# EAGLE design 4x4 (EAGLE 9.6.1)
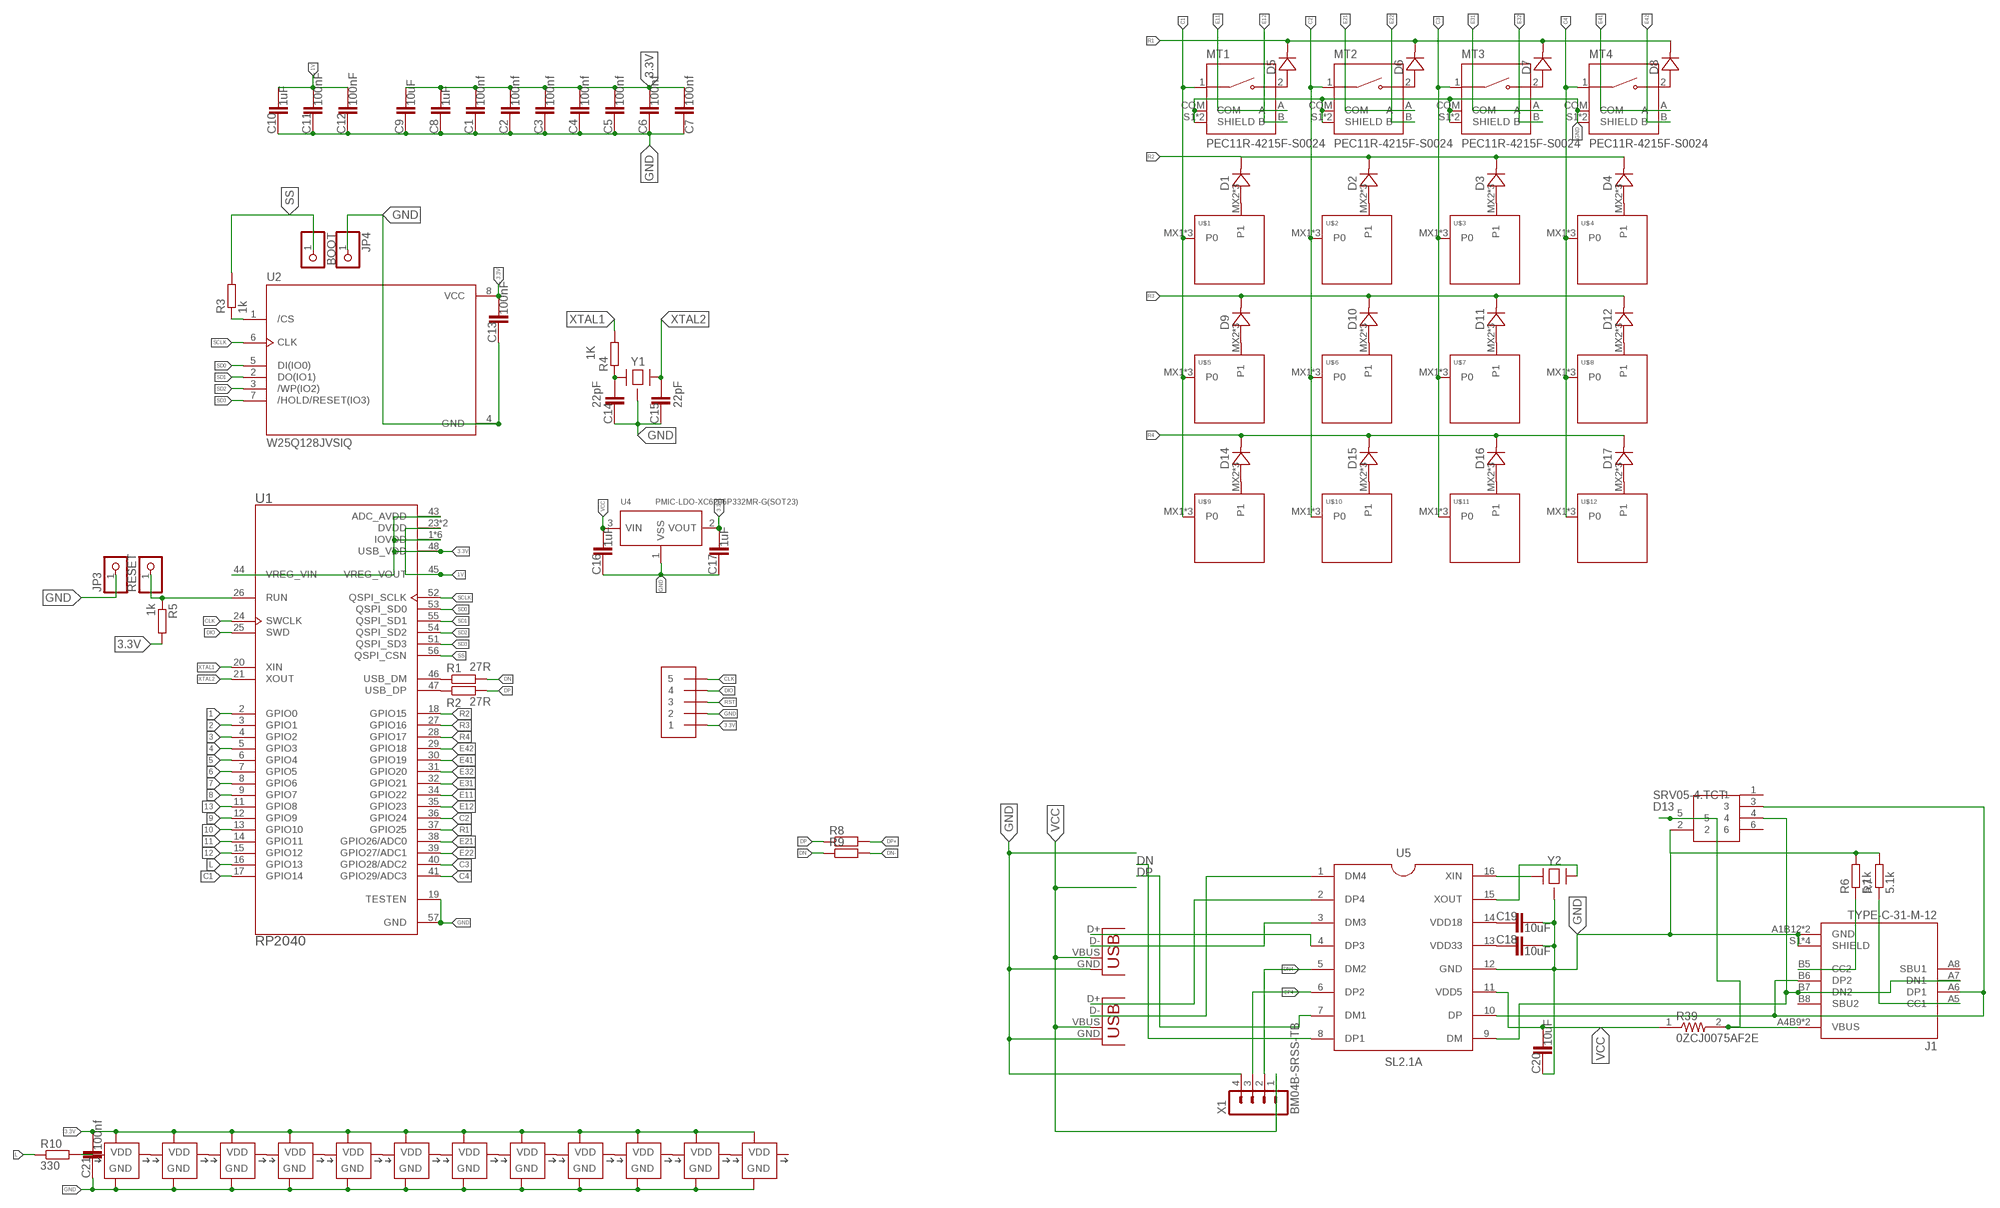
[diagram p0: schematic, sheet 1]

## Parts
BOOT  PINHD-1X1  [1X01]
C1  100nf  CAPACITOR-0603  [C0603]
C2  100nf  CAPACITOR-0603  [C0603]
C3  100nf  CAPACITOR-0603  [C0603]
C4  100nf  CAPACITOR-0603  [C0603]
C5  100nf  CAPACITOR-0603  [C0603]
C6  100nf  CAPACITOR-0603  [C0603]
C7  100nf  CAPACITOR-0603  [C0603]
C8  1uF  CAPACITOR-0603  [C0603]
C9  10uF  CAPACITOR-0603  [C0603]
C10  1uF  CAPACITOR-0603  [C0603]
C11  100nF  CAPACITOR-0603  [C0603]
C12  100nF  CAPACITOR-0603  [C0603]
C13  100nF  CAPACITOR-0603  [C0603]
C14  22pF  CAPACITOR-0603  [C0603]
C15  22pF  CAPACITOR-0603  [C0603]
C16  1uF  CAPACITOR-0603  [C0603]
C17  1uF  CAPACITOR-0603  [C0603]
C18  10uF  CAPACITOR-0603  [C0603]
C19  10uF  CAPACITOR-0603  [C0603]
C20  10uF  CAPACITOR-0603  [C0603]
C21  100nf  CAPACITOR-0603  [C0603]
D1  DIODE-SOD-123  [SOD-123]
D2  DIODE-SOD-123  [SOD-123]
D3  DIODE-SOD-123  [SOD-123]
D4  DIODE-SOD-123  [SOD-123]
D5  DIODE-SOD-123  [SOD-123]
D6  DIODE-SOD-123  [SOD-123]
D7  DIODE-SOD-123  [SOD-123]
D8  DIODE-SOD-123  [SOD-123]
D9  DIODE-SOD-123  [SOD-123]
D10  DIODE-SOD-123  [SOD-123]
D11  DIODE-SOD-123  [SOD-123]
D12  DIODE-SOD-123  [SOD-123]
D13  SRV05-4.TCT  [SOT95P280X145-6N]
D14  DIODE-SOD-123  [SOD-123]
D15  DIODE-SOD-123  [SOD-123]
D16  DIODE-SOD-123  [SOD-123]
D17  DIODE-SOD-123  [SOD-123]
J1  TYPE-C-31-M-12  [HRO_TYPE-C-31-M-12]
J2  1X5  [1X05-3.5MM]
JP3  PINHD-1X1CB  [1X01-CLEANBIG]
JP4  PINHD-1X1CB  [1X01-CLEANBIG]
MT1  PEC11R-4215F-S0024  [XDCR_PEC11R-4215F-S0024]
MT2  PEC11R-4215F-S0024  [XDCR_PEC11R-4215F-S0024]
MT3  PEC11R-4215F-S0024  [XDCR_PEC11R-4215F-S0024]
MT4  PEC11R-4215F-S0024  [XDCR_PEC11R-4215F-S0024]
R1  27R  RESISTOR-0603  [R0603]
R2  27R  RESISTOR-0603  [R0603]
R3  1k  RESISTOR-0603  [R0603]
R4  1K  RESISTOR-0603  [R0603]
R5  1k  RESISTOR-0603  [R0603]
R6  5.1k  RESISTOR-0603  [R0603]
R7  5.1k  RESISTOR-0603  [R0603]
R8  RESISTOR-0405  [R0402]
R9  RESISTOR-0405  [R0402]
R10  330  RESISTOR-0603  [R0603]
R39  0ZCJ0075AF2E  [RESC3216X125N]
RESET  PINHD-1X1  [1X01]
U1  RP2040  [QFN40P700X700X90-57N]
U2  W25Q128JVSIQ  [SOIC127P790X216-8N]
U4  PMIC-LDO-XC6206P332MR-G(SOT23)  [SOT-23]
U5  SL2.1A  [SO16]
U$1  KEYSWITCH-PLAIN-MXHSPCB-1U  [MXHSPCB-1U]
U$2  KEYSWITCH-PLAIN-MXHSPCB-1U  [MXHSPCB-1U]
U$3  KEYSWITCH-PLAIN-MXHSPCB-1U  [MXHSPCB-1U]
U$4  KEYSWITCH-PLAIN-MXHSPCB-1U  [MXHSPCB-1U]
U$5  KEYSWITCH-PLAIN-MXHSPCB-1U  [MXHSPCB-1U]
U$6  KEYSWITCH-PLAIN-MXHSPCB-1U  [MXHSPCB-1U]
U$7  KEYSWITCH-PLAIN-MXHSPCB-1U  [MXHSPCB-1U]
U$8  KEYSWITCH-PLAIN-MXHSPCB-1U  [MXHSPCB-1U]
U$9  KEYSWITCH-PLAIN-MXHSPCB-1U  [MXHSPCB-1U]
U$10  KEYSWITCH-PLAIN-MXHSPCB-1U  [MXHSPCB-1U]
U$11  KEYSWITCH-PLAIN-MXHSPCB-1U  [MXHSPCB-1U]
U$12  KEYSWITCH-PLAIN-MXHSPCB-1U  [MXHSPCB-1U]
U$13  SK6812MINI  [LED-3535]
U$14  SK6812MINI  [LED-3535]
U$15  SK6812MINI  [LED-3535]
U$16  SK6812MINI  [LED-3535]
U$17  SK6812MINI  [LED-3535]
U$18  SK6812MINI  [LED-3535]
U$19  SK6812MINI  [LED-3535]
U$20  SK6812MINI  [LED-3535]
U$21  SK6812MINI  [LED-3535]
U$22  SK6812MINI  [LED-3535]
U$23  SK6812MINI  [LED-3535]
U$24  SK6812MINI  [LED-3535]
X1  BM04B-SRSS-TB  [BM04B-SRSS-TB]
X4  USB-A-H  [USB-A-H]
X5  USB-A-H  [USB-A-H]
Y1  CRYSTAL-4PIN-3.2X2.5  [CRYSTAL-3.2X2.5]
Y2  CRYSTAL-4PIN-3.2X2.5  [CRYSTAL-3.2X2.5]

## Nets
1: U1.2(GPIO0)
1V: C10.2 C11.2 C12.2 U1.23(DVDD) U1.45(VREG_VOUT) U1.50(DVDD)
2: U1.3(GPIO1)
3: U1.4(GPIO2)
3.3V: C1.2 C2.2 C3.2 C4.2 C5.2 C6.2 C7.2 C8.2 C9.2 C13.2 C17.2 C21.2 J2.1 R5.2 U1.1(IOVDD) U1.10(IOVDD) U1.22(IOVDD) U1.33(IOVDD) U1.42(IOVDD) U1.43(ADC_AVDD) U1.44(VREG_VIN) U1.48(USB_VDD) U1.49(IOVDD) U2.8(VCC) U4.2(VOUT) U$13.4(VDD) U$14.4(VDD) U$15.4(VDD) U$16.4(VDD) U$17.4(VDD) U$18.4(VDD) U$19.4(VDD) U$20.4(VDD) U$21.4(VDD) U$22.4(VDD) U$23.4(VDD) U$24.4(VDD)
4: U1.5(GPIO3)
5: U1.6(GPIO4)
6: U1.7(GPIO5)
7: U1.8(GPIO6)
8: U1.9(GPIO7)
9: U1.12(GPIO9)
10: U1.13(GPIO10)
11: U1.14(GPIO11)
12: U1.15(GPIO12)
13: U1.11(GPIO8)
C1: MT1.1 U1.17(GPIO14) U$1.MX1(P0) U$1.P$1(P0) U$1.P$2(P0) U$5.MX1(P0) U$5.P$1(P0) U$5.P$2(P0) U$9.MX1(P0) U$9.P$1(P0) U$9.P$2(P0)
C2: MT2.1 U1.36(GPIO24) U$2.MX1(P0) U$2.P$1(P0) U$2.P$2(P0) U$6.MX1(P0) U$6.P$1(P0) U$6.P$2(P0) U$10.MX1(P0) U$10.P$1(P0) U$10.P$2(P0)
C3: MT3.1 U1.40(GPIO28/ADC2) U$3.MX1(P0) U$3.P$1(P0) U$3.P$2(P0) U$7.MX1(P0) U$7.P$1(P0) U$7.P$2(P0) U$11.MX1(P0) U$11.P$1(P0) U$11.P$2(P0)
C4: MT4.1 U1.41(GPIO29/ADC3) U$4.MX1(P0) U$4.P$1(P0) U$4.P$2(P0) U$8.MX1(P0) U$8.P$1(P0) U$8.P$2(P0) U$12.MX1(P0) U$12.P$1(P0) U$12.P$2(P0)
CLK: J2.5 U1.24(SWCLK)
DIO: J2.4 U1.25(SWD)
DN: R1.2 R9.1 U5.8(DP1)
DN4: U5.5(DM2) X1.2
DN-: D13.4 J1.A7(DN1) J1.B7(DN2) R9.2 U5.9(DM)
DP: R2.2 R8.1 U5.7(DM1)
DP4: U5.6(DP2) X1.3
DP+: D13.3 J1.A6(DP1) J1.B6(DP2) R8.2 U5.10(DP)
E11: MT1.A U1.34(GPIO22)
E12: MT1.B U1.35(GPIO23)
E21: MT2.A U1.38(GPIO26/ADC0)
E22: MT2.B U1.39(GPIO27/ADC1)
E31: MT3.A U1.32(GPIO21)
E32: MT3.B U1.31(GPIO20)
E41: MT4.A U1.30(GPIO19)
E42: MT4.B U1.29(GPIO18)
GND: C1.1 C2.1 C3.1 C4.1 C5.1 C6.1 C7.1 C8.1 C9.1 C10.1 C11.1 C12.1 C13.1 C14.1 C15.1 C16.1 C17.1 C18.2 C19.2 C20.1 C21.1 D13.2 J1.A1B12(GND) J1.B1A12(GND) J1.S1(SHIELD) J1.S2(SHIELD) J1.S3(SHIELD) J1.S4(SHIELD) J2.2 JP3.1 JP4.1 MT1.COM MT1.S1(SHIELD) MT1.S2(SHIELD) MT2.COM MT2.S1(SHIELD) MT2.S2(SHIELD) MT3.COM MT3.S1(SHIELD) MT3.S2(SHIELD) MT4.COM MT4.S1(SHIELD) MT4.S2(SHIELD) R6.2 R7.2 U1.19(TESTEN) U1.57(GND) U2.4(GND) U4.1(VSS) U5.12(GND) U$13.2(GND) U$14.2(GND) U$15.2(GND) U$16.2(GND) U$17.2(GND) U$18.2(GND) U$19.2(GND) U$20.2(GND) U$21.2(GND) U$22.2(GND) U$23.2(GND) U$24.2(GND) X1.4 X4.GND X5.GND Y1.2(GND) Y1.4(GND) Y2.2(GND) Y2.4(GND)
L: R10.1 U1.16(GPIO13)
N$7: D13.5 J1.A4B9(VBUS) J1.B4A9(VBUS) R39.2
N$8: U$13.1(DI) U$19.3(DO)
N$9: U$13.3(DO) U$14.1(DI)
N$10: U$14.3(DO) U$15.1(DI)
N$11: U$15.3(DO) U$16.1(DI)
N$12: U$16.3(DO) U$20.1(DI)
N$13: R1.1 U1.46(USB_DM)
N$14: R2.1 U1.47(USB_DP)
N$15: C14.2 R4.1 Y1.1
N$16: R3.1 U2.1(/CS)
N$17: D1.A U$1.MX2(P1) U$1.P$3(P1) U$1.P$4(P1)
N$18: D2.A U$2.MX2(P1) U$2.P$3(P1) U$2.P$4(P1)
N$19: C18.1 U5.13(VDD33)
N$20: C19.1 U5.14(VDD18)
N$21: U5.16(XIN) Y2.1
N$22: U5.15(XOUT) Y2.3
N$23: U5.2(DP4) X5.D+
N$24: U5.1(DM4) X5.D-
N$25: U$20.3(DO) U$21.1(DI)
N$26: U$21.3(DO) U$22.1(DI)
N$27: U5.3(DM3) X4.D-
N$28: U5.4(DP3) X4.D+
N$29: U$22.3(DO) U$23.1(DI)
N$30: U$23.3(DO) U$24.1(DI)
N$31: D3.A U$3.MX2(P1) U$3.P$3(P1) U$3.P$4(P1)
N$32: D4.A U$4.MX2(P1) U$4.P$3(P1) U$4.P$4(P1)
N$33: D5.A MT1.2
N$34: D6.A MT2.2
N$35: D7.A MT3.2
N$36: D8.A MT4.2
N$37: D9.A U$5.MX2(P1) U$5.P$3(P1) U$5.P$4(P1)
N$38: D10.A U$6.MX2(P1) U$6.P$3(P1) U$6.P$4(P1)
N$39: D11.A U$7.MX2(P1) U$7.P$3(P1) U$7.P$4(P1)
N$40: D12.A U$8.MX2(P1) U$8.P$3(P1) U$8.P$4(P1)
N$41: D14.A U$9.MX2(P1) U$9.P$3(P1) U$9.P$4(P1)
N$42: D15.A U$10.MX2(P1) U$10.P$3(P1) U$10.P$4(P1)
N$43: D16.A U$11.MX2(P1) U$11.P$3(P1) U$11.P$4(P1)
N$44: D17.A U$12.MX2(P1) U$12.P$3(P1) U$12.P$4(P1)
N$107: U$17.3(DO) U$18.1(DI)
N$108: U$18.3(DO) U$19.1(DI)
N$153: J1.B5(CC2) R6.1
N$154: J1.A5(CC1) R7.1
R1: D5.C D6.C D7.C D8.C U1.37(GPIO25)
R2: D1.C D2.C D3.C D4.C U1.18(GPIO15)
R3: D9.C D10.C D11.C D12.C U1.27(GPIO16)
R4: D14.C D15.C D16.C D17.C U1.28(GPIO17)
RGB: R10.2 U$17.1(DI)
RST: J2.3 R5.1 RESET.1 U1.26(RUN)
SCLK: U1.52(QSPI_SCLK) U2.6(CLK)
SD0: U1.53(QSPI_SD0) U2.5(DI(IO0))
SD1: U1.55(QSPI_SD1) U2.2(DO(IO1))
SD2: U1.54(QSPI_SD2) U2.3(/WP(IO2))
SD3: U1.51(QSPI_SD3) U2.7(/HOLD/RESET(IO3))
SS: BOOT.1 R3.2 U1.56(QSPI_CSN)
VCC: C16.2 C20.2 R39.1 U4.3(VIN) U5.11(VDD5) X1.1 X4.VBUS X5.VBUS
XTAL1: R4.2 U1.20(XIN)
XTAL2: C15.2 U1.21(XOUT) Y1.3
Unconnected: D13.1 D13.6 J1.A8(SBU1) J1.B8(SBU2) U$24.3(DO)

## Library data of the parts
BOOT JP3 JP4 RESET = adafruit:PINHD-1X1: Pin header 1x1 for 0.1" spacing With round pins
C1-C21 = Components:CAPACITOR
D1-D12 D14-D17 = Components:DIODE: Standard 1N4148 diode
D13 = SRV05-4.TCT:SRV05-4.TCT: Semtech SRV05-4.TCT, Uni-Directional TVS Diode Array, 300W, 6-Pin SOT-23 Source: Datasheet Check prices; AVAILABILITY: In Stock; DESCRIPTION: 17.5V Clamp 12A (8/20µs) Ipp Tvs Diode Surface Mount SOT-23-6; MF: Semtech; MP: SRV05-4.TC; PACKAGE: SOT-23-6 Semtech; PRICE: None; PURCHASE-URL: https://pricing.snapeda.com/search/part/SRV05-4.TC/?ref=eda
J1 = TYPE-C-31-M-12:TYPE-C-31-M-12: USB Connectors 24 Receptacle 1 8.94*7.3mm RoHS; AVAILABILITY: Unavailable; DESCRIPTION: USB Connectors 24 Receptacle 1 8.94*7.3mm RoHS; MF: HRO Electronics Co., Ltd.; MP: TYPE-C-31-M-12; PACKAGE: Package; PRICE: None
J2 = adafruit:1X5
MT1-MT4 = PEC11R-4215F-S0024:PEC11R-4215F-S0024: Incremental Encoder, 12 Mm, Contact Rating 10 Ma - 5 Vdc Check prices; AVAILABILITY: In Stock; DESCRIPTION: Rotary Encoder Mechanical 24 Quadrature (Incremental) Vertical; MF: Bourns; MP: PEC11R-4215F-S0024; PACKAGE: None; PRICE: None
R1-R10 = Components:RESISTOR
R39 = fuse:0ZCJ0075AF2E: PTC RESTTBLE 0.75A 16V CHIP 1206 Check prices; AVAILABILITY: In Stock; DESCRIPTION: 1206 SMT PPTC | 0.75 Ih | 16V; MF: Bel Fuse; MP: 0ZCJ0075AF2E; PACKAGE: 1206 Bel Fuse; PRICE: None; PURCHASE-URL: https://pricing.snapeda.com/search/part/0ZCJ0075AF2E/?ref=eda
U1 = RP2040:RP2040: Check availability; AVAILABILITY: In Stock; DESCRIPTION: RP2040 chip for Raspberry Pi Pico - ARM® Cortex®-M0+ MCU 32-Bit; MF: Raspberry Pi; MP: RP2040; PACKAGE: None; PRICE: None; PURCHASE-URL: https://pricing.snapeda.com/search/part/RP2040/?ref=eda
U2 = W25Q128JVSIQ:W25Q128JVSIQ: Check availability; AVAILABILITY: In Stock; DESCRIPTION: FLASH - NOR Memory IC 128Mb (16M x 8) SPI - Quad I/O, QPI, DTR 133 MHz 8-SOIC; MF: Winbond Electronics; MP: W25Q128JVSIQ; PACKAGE: SOIC-8 Winbond; PRICE: None; PURCHASE-URL: https://pricing.snapeda.com/search/part/W25Q128JVSIQ/?ref=eda
U4 = C5446-XC6206P332MR-G_SOT23_:PMIC-LDO-XC6206P332MR-G(SOT23): 310030099 Check availability; AVAILABILITY: In Stock; DESCRIPTION: Linear Voltage Regulator IC Positive Fixed 1 Output 200mA SOT-23; MF: Torex; MP: XC6206P332MR-G; PACKAGE: SOT-23-3 Torex; PRICE: None; PURCHASE-URL: https://pricing.snapeda.com/search/part/XC6206P332MR-G/?ref=eda
U5 = SL2.1A:SL2.1A: Check prices; AVAILABILITY: Not in stock; DESCRIPTION: USB 2.0 HIGH SPEED 4-PORT HUB CONTROLLER; MF: CoreChips ShenZhen CO.,Ltd; MP: SL2.1A; PACKAGE: Package; PRICE: None
U$1-U$12 = Keyboard:KEYSWITCH-PLAIN
U$13-U$24 = SK6812MINI:SK6812MINI: Check availability; AVAILABILITY: Not in stock; DESCRIPTION: INTEGRATED LIGHT SOURCE INTELLIGENT CONTROL OF CHIP-ON-TOP SMD TYPE LED; MF: DONGGUANG OPSCO OPTOELECTRONICS CO., LTD; MP: SK6812MINI; PACKAGE: Package; PRICE: None
X1 = con-JST SH:BM04B-SRSS: JST SH series header 1.00mm pitch disconnectable crimp style connectors, vertical (side entry type), 4 pins
X4 X5 = con-usb:USB: USB Connectors
Y1 Y2 = Components:CRYSTAL-4PIN

## Board
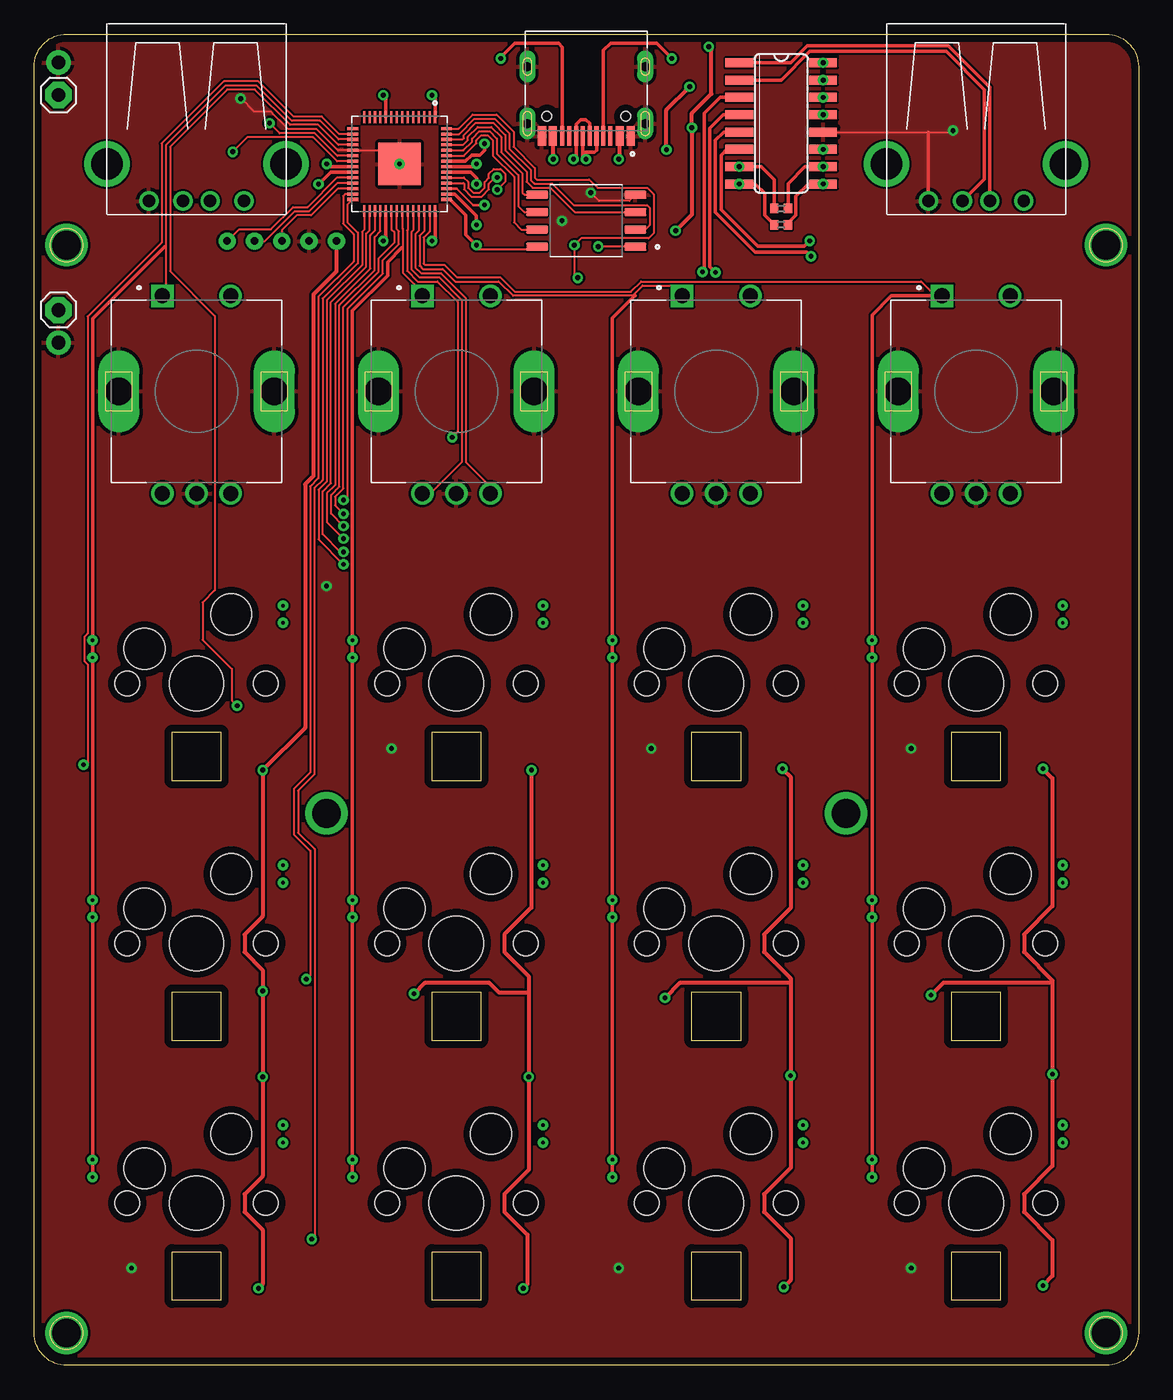
[diagram p1: board, top side]
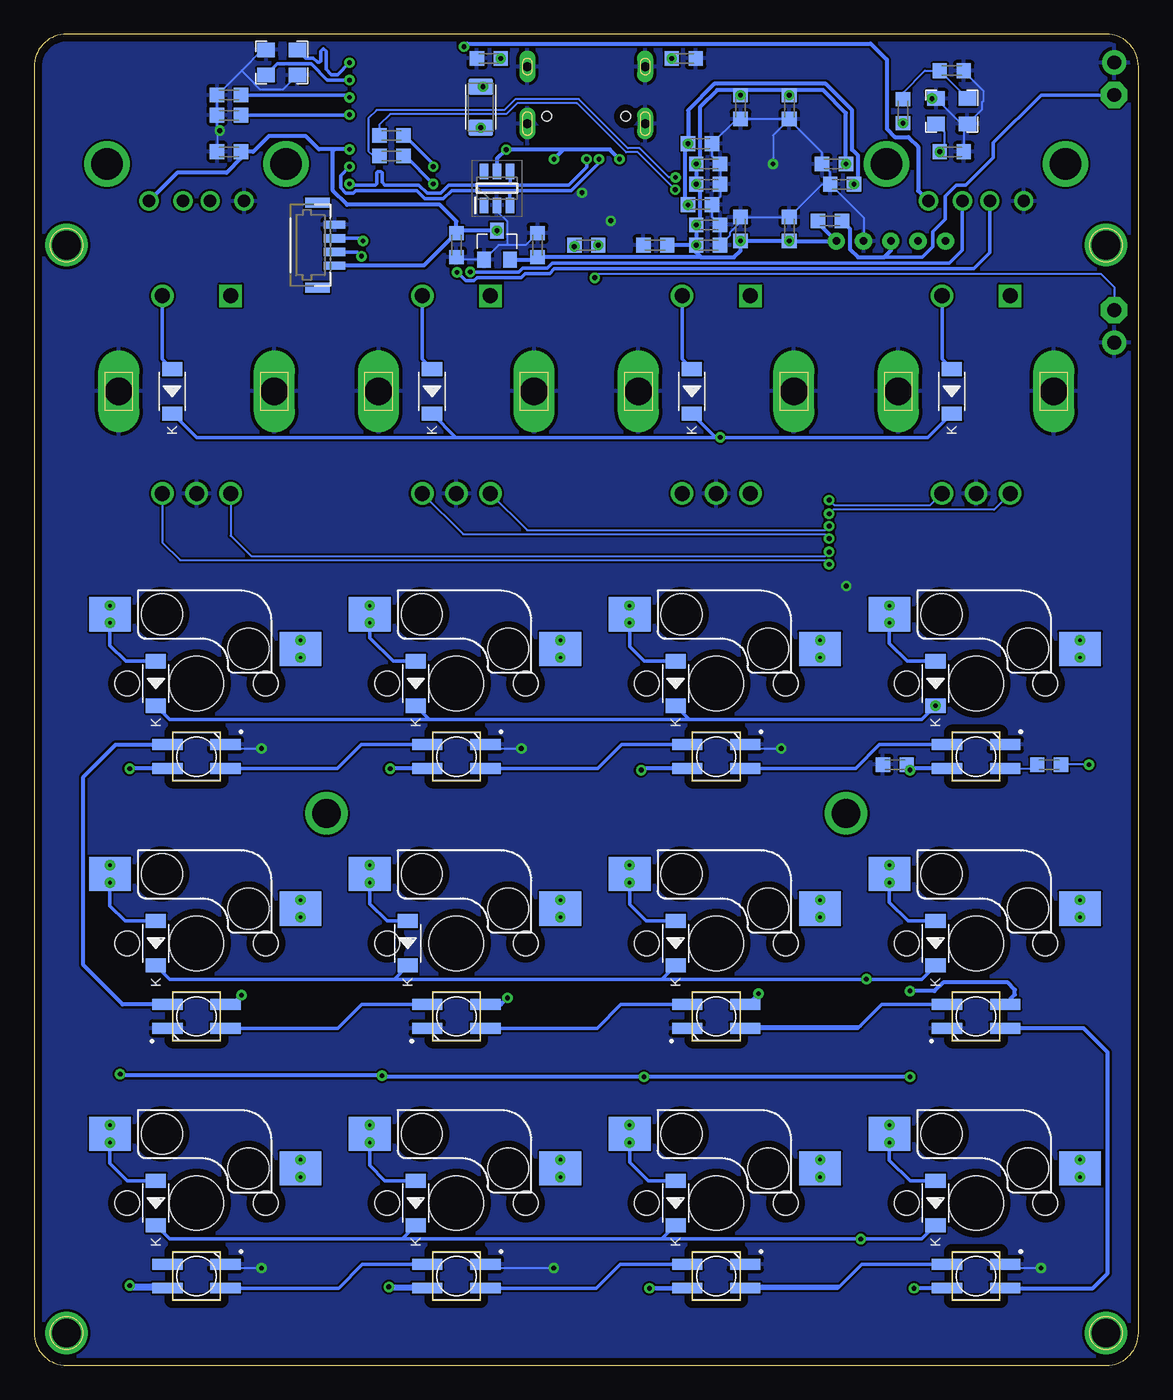
[diagram p2: board, bottom side, seen from below]

Size 80.96 x 97.63 mm. Coordinates in mm from the lower left corner, seen from the top.
Outline: 56 segments
Outline: circle at 2.38,82.15 radius 1.2
Outline: circle at 78.58,82.15 radius 1.2
Outline: circle at 78.58,2.38 radius 1.2
Outline: circle at 2.38,2.38 radius 1.2
Copper layers (1*16): Top 0.035mm / dielectric 1.5mm / Bottom 0.035mm
Design rules "default *": minimum track width 6mil, minimum drill 0.35mm, track to track 6mil, track to pad 6mil, pad to pad 6mil, via to via 6mil, smd to smd 6mil, copper to edge 20mil, drill to drill 6mil, minimum pad ring 10mil, minimum via ring 8mil, stop-mask expansion 4mil, vias tented up to drill 14mil, thermal gap 10mil

### Footprints (pad centres in the part's own frame; a part is rotated, then mirrored left to right if it is on the bottom)
1X01 = drill 1.016 pad 1.93 octagon: 1 0,0
C0603 = smd 1.05 x 1.08: 1 -0.875,0; 2 0.875,0
SOD-123 = smd 1.037 x 1.474: A -1.635,0; C 1.635,0
SOT95P280X145-6N = smd 1.15 x 0.6: 1 -1.25,0.95; 2 -1.25,0; 3 -1.25,-0.95; 4 1.25,-0.95; 5 1.25,0; 6 1.25,0.95
HRO_TYPE-C-31-M-12 = smd 0.6 x 1.45: A1B12 -3.25,5.095; A4B9 -2.45,5.095; B1A12 3.25,5.095; B4A9 2.45,5.095 | smd 0.3 x 1.45: A5 -1.25,5.095; A6 -0.25,5.095; A7 0.25,5.095; A8 1.25,5.095; B5 1.75,5.095; B6 0.75,5.095; B7 -0.75,5.095; B8 -1.75,5.095 | drill 0.65 pad 1.05 long: S1 -4.32,4.18; S2 4.32,4.18; S3 -4.32,0; S4 4.32,0 | hole 0.7: -2.89,3.65; 2.89,3.65
1X05-3.5MM = drill 0.55 pad 1.27: 1 4,0; 2 2,0; 3 0,0; 4 -2,0; 5 -4,0
1X01-CLEANBIG = drill 1.016 pad 1.778: 1 0,0
XDCR_PEC11R-4215F-S0024 = drill 1.1 square: 1 -2.5,7 | drill 1.1: 2 2.5,7; A -2.5,-7.5; B 2.5,-7.5; COM 0,-7.5 | drill 2 pad 2.184 long: S1 -5.7,0; S2 5.7,0
R0603 = smd 1.05 x 1.08: 1 -0.875,0; 2 0.875,0
R0402 = smd 0.6 x 0.7: 1 -0.5,0; 2 0.5,0
RESC3216X125N = smd 1.2 x 1.82: 1 -1.505,0; 2 1.505,0
QFN40P700X700X90-57N = smd 0.84 x 0.2: 1 -3.435,2.6; 2 -3.435,2.2; 3 -3.435,1.8; 4 -3.435,1.4; 5 -3.435,1; 6 -3.435,0.6; 7 -3.435,0.2; 8 -3.435,-0.2; 9 -3.435,-0.6; 10 -3.435,-1; 11 -3.435,-1.4; 12 -3.435,-1.8; 13 -3.435,-2.2; 14 -3.435,-2.6; 29 3.435,-2.6; 30 3.435,-2.2; 31 3.435,-1.8; 32 3.435,-1.4; 33 3.435,-1; 34 3.435,-0.6; 35 3.435,-0.2; 36 3.435,0.2; 37 3.435,0.6; 38 3.435,1; 39 3.435,1.4; 40 3.435,1.8; 41 3.435,2.2; 42 3.435,2.6 | smd 0.2 x 0.84: 15 -2.6,-3.435; 16 -2.2,-3.435; 17 -1.8,-3.435; 18 -1.4,-3.435; 19 -1,-3.435; 20 -0.6,-3.435; 21 -0.2,-3.435; 22 0.2,-3.435; 23 0.6,-3.435; 24 1,-3.435; 25 1.4,-3.435; 26 1.8,-3.435; 27 2.2,-3.435; 28 2.6,-3.435; 43 2.6,3.435; 44 2.2,3.435; 45 1.8,3.435; 46 1.4,3.435; 47 1,3.435; 48 0.6,3.435; 49 0.2,3.435; 50 -0.2,3.435; 51 -0.6,3.435; 52 -1,3.435; 53 -1.4,3.435; 54 -1.8,3.435; 55 -2.2,3.435; 56 -2.6,3.435 | smd 3.1 x 3.1: 57 0,0
SOIC127P790X216-8N = smd 1.61 x 0.58: 1 -3.605,1.905; 2 -3.605,0.635; 3 -3.605,-0.635; 4 -3.605,-1.905; 5 3.605,-1.905; 6 3.605,-0.635; 7 3.605,0.635; 8 3.605,1.905
SOT-23 = smd 1.016 x 1.2: 1 -0.95,-1.06; 2 0.95,-1.06; 3 0,1.06
SO16 = smd 0.66 x 2.032: 1 -4.445,-3.073; 2 -3.175,-3.073; 3 -1.905,-3.073; 4 -0.635,-3.073; 5 0.635,-3.073; 6 1.905,-3.073; 7 3.175,-3.073; 8 4.445,-3.073; 9 4.445,3.073; 10 3.175,3.073; 11 1.905,3.073; 12 0.635,3.073; 13 -0.635,3.073; 14 -1.905,3.073; 15 -3.175,3.073; 16 -4.445,3.073
MXHSPCB-1U = smd 3.058 x 2.5: MX1 7.614,2.54; MX2 -6.344,5.08 | drill 0.25 pad 0.406: P$1 7.62,3.175; P$2 7.62,1.905; P$3 -6.35,5.715; P$4 -6.35,4.445 | hole 4: 0,0 | hole 1.802: 5.08,0; -5.08,0 | hole 3: 3.81,2.54; -2.54,5.08
LED-3535 = smd 2.216 x 0.8: 1 -2.133,0.875; 2 -2.133,-0.875; 3 2.133,-0.875; 4 2.133,0.875
BM04B-SRSS-TB = smd 0.6 x 1.55: 1 1.5,0; 2 0.5,0; 3 -0.5,0; 4 -1.5,0 | smd 0.762 x 1.8: M1 3.118,-1.255; M2 -3.118,-1.255
USB-A-H = drill 0.914: D+ 2.718,-1.003; D- 2.718,1.003; GND 2.718,-3.493; VBUS 2.718,3.493 | drill 2.311: P$5 0,-6.566; P$6 0,6.566
CRYSTAL-3.2X2.5 = smd 1.3 x 1.05: 1 -1.15,-0.925; 2 1.15,-0.925; 3 1.15,0.925; 4 -1.15,0.925

### Placement (x,y rotation side)
BOOT  1.79,77.39 270 top
C1  31.55,88.11 180 bottom
C2  31.55,82.15 180 bottom
C3  25.6,92.27 90 bottom
C4  31.55,83.64 180 bottom
C5  25.6,83.34 270 bottom
C6  22.32,88.11 0 bottom
C7  31.55,86.62 180 bottom
C8  29.17,83.34 270 bottom
C9  29.17,92.27 90 bottom
C10  21.73,86.62 0 bottom
C11  32.15,89.59 180 bottom
C12  32.15,85.13 180 bottom
C13  35.42,82.15 0 bottom
C14  13.69,94.95 180 bottom
C15  13.69,89 180 bottom
C16  50.01,82.15 90 bottom
C17  44.05,82.15 270 bottom
C18  66.67,91.68 180 bottom
C19  66.67,93.17 180 bottom
C20  66.67,89 0 bottom
C21  17.86,44.05 0 bottom
D1  14.88,50.01 270 bottom
D2  33.93,50.01 270 bottom
D3  52.98,50.01 270 bottom
D4  72.03,50.01 270 bottom
D5  13.69,71.44 270 bottom
D6  32.74,71.44 270 bottom
D7  51.79,71.44 270 bottom
D8  70.84,71.44 270 bottom
D9  14.88,30.96 270 bottom
D10  33.93,30.96 270 bottom
D11  53.58,30.96 270 bottom
D12  72.03,30.96 270 bottom
D13  47.03,86.32 90 bottom
D14  14.88,11.91 270 bottom
D15  33.93,11.91 270 bottom
D16  52.98,11.91 270 bottom
D17  72.03,11.91 270 bottom
J1  40.48,95.25 180 top
J2  18.16,82.45 0 top
JP3  1.79,95.55 90 top
JP4  1.79,75.01 270 top
MT1  11.91,71.44 0 top
MT2  30.96,71.44 0 top
MT3  50.01,71.44 0 top
MT4  69.06,71.44 0 top
R1  54.77,88.7 0 bottom
R2  54.77,90.19 0 bottom
R3  40.48,82.15 0 bottom
R4  17.26,91.98 270 bottom
R5  22.62,83.94 180 bottom
R6  33.34,95.85 0 bottom
R7  47.62,95.85 180 bottom
R8  54.77,84.83 0 top
R9  54.77,83.64 0 top
R10  6.55,44.05 180 bottom
R39  48.22,92.27 90 bottom
RESET  1.79,93.17 90 top
U1  26.79,88.11 270 top
U2  40.48,83.94 180 top
U4  47.03,82.15 0 bottom
U5  54.77,91.08 270 top
U$1  11.91,50.01 0 bottom
U$2  30.96,50.01 0 bottom
U$3  50.01,50.01 0 bottom
U$4  69.06,50.01 0 bottom
U$5  11.91,30.96 0 bottom
U$6  30.96,30.96 0 bottom
U$7  50.01,30.96 0 bottom
U$8  69.06,30.96 0 bottom
U$9  11.91,11.91 0 bottom
U$10  30.96,11.91 0 bottom
U$11  50.01,11.91 0 bottom
U$12  69.06,11.91 0 bottom
U$13  69.06,44.65 180 bottom
U$14  69.06,25.6 0 bottom
U$15  50.01,25.6 0 bottom
U$16  30.96,25.6 0 bottom
U$17  11.91,44.65 180 bottom
U$18  30.96,44.65 180 bottom
U$19  50.01,44.65 180 bottom
U$20  11.91,25.6 0 bottom
U$21  11.91,6.55 180 bottom
U$22  30.96,6.55 180 bottom
U$23  50.01,6.55 180 bottom
U$24  69.06,6.55 180 bottom
X1  58.94,82.15 270 bottom
X4  11.91,88.11 270 top
X5  69.06,88.11 270 top
Y1  13.69,91.98 180 bottom
Y2  62.81,95.55 180 bottom

### Tracks (layer width: path | path; a pad name or v marks a point on that pad's centre or on a via)
1V  (via drill 0.35)
  Top 0.2: U1.45 30.98,86.31 32.19,85.1 v33.02,85.1
  Top 0.254: U1.50 31.61,88.31 32.07,88.76 32.67,88.76 33.02,89.12 C11.2 | U1.23 21.74,87.51 C10.2
  Bottom 0.2: v33.02,85.1 C12.2
  Bottom 0.305: C10.2 20.56,86.91 20.56,88.71 20.99,89.15 20.99,92.03 22.94,93.98 31.09,93.98 33.02,92.04 C11.2 33.26,89.36 33.26,85.37 C12.2
  other vias: 33.02,89.59 20.85,86.62
3.3V  (via drill 0.35)
  Top 0.152: U2.8 36.86,81.86 32.36,81.86 C2.2
  Top 0.254: U1.10 25.79,92.96 C3.2 | U1.1 29.39,92.93 C9.2 | U1.49 32.23,87.91 C1.2 | U1.48 32.01,87.51 32.46,87.06 32.46,86.65 C7.2 | U1.44 30.85,85.91 32.43,84.33 C4.2 | U1.43 30.51,85.51 31.66,84.36 31.66,82.92 C2.2 | U1.42 29.39,82.68 C8.2 | U1.33 25.79,82.66 C5.2 | U1.22 21.65,87.91 C6.2
  Top 0.305: v16.46,5.66 16.76,5.96 16.76,9.93 15.43,11.26 15.43,12.55 16.76,13.88 v16.76,21.16 v16.76,27.46 16.76,28.98 15.43,30.31 15.43,31.6 16.76,32.93 v16.76,43.66 19.86,46.76 19.86,64.62 20.47,65.23 20.47,78.53 22.16,80.22 J2.1 | v36.46,43.66 36.46,33.58 34.48,31.6 34.48,30.31 36.26,28.53 36.26,27.36 | v35.86,5.66 36.16,5.96 36.16,9.58 34.48,11.26 34.48,12.55 36.26,14.33 v36.26,21.16 36.26,27.36 | v27.86,27.26 28.68,28.08 33.33,28.08 34.06,27.36 36.26,27.36 | v54.86,43.76 55.46,43.16 55.46,33.53 53.53,31.6 53.53,30.31 55.46,28.38 55.46,27.96 | v54.96,5.76 55.46,6.26 55.46,9.33 53.53,11.26 53.53,12.55 55.46,14.48 v55.46,21.26 55.46,27.96 | v46.26,26.96 47.38,28.08 55.33,28.08 55.46,27.96 | v73.96,43.76 74.66,43.06 74.66,33.68 72.58,31.6 72.58,30.31 74.66,28.23 74.66,27.96 | v73.96,5.86 74.66,6.56 74.66,9.18 72.58,11.26 72.58,12.55 74.66,14.63 v74.66,21.36 74.66,27.96 | v65.76,27.16 66.68,28.08 74.53,28.08 74.66,27.96
  Bottom 0.305: C6.2 21.45,91.84 23.13,93.52 25.29,93.52 | C3.2 25.66,93.15 25.29,93.52 | C2.2 C4.2 32.16,83.91 32.16,86.35 C7.2 C1.2 32.16,88.37 32.16,92.26 30.9,93.52 29.06,93.52 | C2.2 C13.2 | C2.2 32.43,81.62 32.06,81.26 | 32.06,81.26 29.66,81.26 29.17,81.75 C8.2 C5.2 25.58,82.45 J2.1 23.5,83.79 R5.2 | 25.29,93.52 29.06,93.52 | C9.2 29.06,93.26 29.06,93.52 | U4.2 44.24,81.09 C17.2 44.03,81.26 32.06,81.26 | U$17.4 16.64,43.77 v16.76,43.66 16.76,43.83 C21.2 | U$21.4 16.44,5.67 v16.46,5.66 | U$20.4 9.06,27.19 9.06,27.56 9.58,28.08 14.33,28.08 14.96,27.46 v16.76,27.46 | U$18.4 36.34,43.77 v36.46,43.66 | 33.44,5.67 33.46,5.66 v35.86,5.66 35.84,5.67 U$22.4 | U$16.4 28.64,26.47 v27.86,27.26 | U$19.4 54.84,43.77 v54.86,43.76 | 52.49,5.67 54.87,5.67 v54.96,5.76 52.22,5.76 U$23.4 | U$15.4 46.74,26.47 v46.26,26.96 | U$13.4 73.94,43.77 v73.96,43.76 | 71.54,5.67 73.77,5.67 v73.96,5.86 71.37,5.86 U$24.4 | U$14.4 66.44,26.47 v65.76,27.16 | v16.76,21.16 v36.26,21.16 55.36,21.16 v55.46,21.26 74.56,21.26 v74.66,21.36
  other vias: 25.6,93.15 29.17,93.15 32.43,88.11 32.43,86.62 32.43,83.64 32.43,82.15 29.17,82.47 25.6,82.47 21.45,88.11
C1
  Top 0.152: U1.17 22.33,89.91 20.96,91.28 18.9,91.28 16.31,93.86 14.03,93.86 9.66,89.49 9.66,82.14 | MT1.1 9.66,78.69 9.66,82.14 | 9.66,82.14 9.42,81.9
  Top 0.254: U$9.P$2 U$9.P$1 U$5.P$2 U$5.P$1 U$1.P$2 U$1.P$1 4.29,76.77 9.42,81.9 9.58,82.06 9.61,82.06
  Bottom 0.254: U$1.P$1 U$1.MX1 U$1.P$2 | U$5.MX1 U$5.P$1 | U$9.MX1 U$9.P$1
C2
  Top 0.152: U1.36 26.99,83.42 | 26.99,83.42 27.04,83.37 | 26.99,83.42 26.99,83.35 27.04,83.3 27.04,82.03 26.96,81.96 | 26.99,81.96 27.04,81.91 27.04,80.14 28.46,78.73 MT2.1
  Top 0.254: U$10.P$2 U$10.P$1 U$6.P$2 U$6.P$1 U$2.P$2 U$2.P$1 23.34,77.34 25.92,79.92 25.92,80.91 26.96,81.96 26.99,81.96
  Bottom 0.254: U$10.MX1 U$10.P$1 | U$6.MX1 U$6.P$1 | U$2.MX1 U$2.P$1
C3
  Top 0.152: U1.40 28.59,83.18 28.26,82.85 28.26,80.65 28.5,80.41 29.94,80.41 30.86,79.49 34.06,79.49 35.11,78.44 43.87,78.44 | 43.87,78.44 44.06,78.44 44.06,78.63 | MT3.1 46.76,79.19 44.62,79.19 44.06,78.63 | 44.06,78.63 43.87,78.44
  Top 0.254: U$11.P$2 U$11.P$1 U$7.P$2 U$7.P$1 U$3.P$2 U$3.P$1 42.39,76.79 44.04,78.44 44.06,78.44
  Bottom 0.254: U$11.MX1 U$11.P$1 | U$7.MX1 U$7.P$1 | U$3.MX1 U$3.P$1
C4
  Top 0.152: U1.41 28.99,83.15 28.56,82.72 28.56,80.8 28.66,80.71 30.07,80.71 30.99,79.8 34.18,79.8 35.24,78.74 43.74,78.74 44.49,79.49 65.02,79.49 66.08,78.44 MT4.1
  Top 0.254: U$12.P$2 U$12.P$1 U$8.P$2 U$8.P$1 U$4.P$2 U$4.P$1 61.44,77.04 62.84,78.44 MT4.1
  Bottom 0.254: U$12.MX1 U$12.P$1 | U$8.MX1 U$8.P$1 | U$4.MX1 U$4.P$1
CLK
  Top 0.152: U1.24 22.2,87.11 20.05,84.96 18.99,84.96 17.35,83.31 15.02,83.31 J2.5
DIO
  Top 0.152: U1.25 22.23,86.71 20.18,84.65 19.12,84.65 16.92,82.45 J2.4
DN  (via drill 0.35)
  Top 0.254: U5.8 52.87,86.64 53.56,85.96 53.56,84.35 R9.1
  Bottom 0.254: U5.8 53.76,88.7 R1.2
  other vias: 51.7,86.64
DN4  (via drill 0.35)
  Top 0.254: U5.5 50.55,90.45 49.95,89.85 49.95,84.59 52.88,81.66 56.64,81.66 v56.96,81.34
  Bottom 0.254: v56.96,81.34 57.27,81.65 X1.2
DN-  (via drill 0.35)
  Top 0.254: J1.A7 40.23,89.08 | 40.23,89.08 40.36,88.96 41.06,88.96 41.23,89.13 J1.B7 | 40.23,89.08 40.23,88.68 v40.46,88.46 | U5.9 56.74,86.64 55.85,85.75 55.85,84.37 55.27,83.79 R9.2
  Bottom 0.254: v40.46,88.46 40.46,87.86 41.76,86.56 45.96,86.56 | 45.96,86.56 46.06,86.66 46.06,87.55 D13.4 | U5.9 57.76,86.56 55.96,86.56 55.86,86.66 55.86,87.46 55.76,87.56 55.56,87.56 55.46,87.46 55.46,86.76 55.26,86.56 52.76,86.56 52.16,85.96 51.16,85.96 50.56,86.56 45.96,86.56
  other vias: 57.84,86.64
DP  (via drill 0.35)
  Top 0.254: U5.7 53.3,87.91 54.27,86.94 R8.1
  Bottom 0.254: U5.7 51.7,88.1 53.79,90.19 R2.2
  other vias: 51.7,87.91
DP4  (via drill 0.35)
  Top 0.254: U5.6 50.78,89.18 50.36,88.76 50.36,84.76 53.05,82.06 56.46,82.06 v56.86,82.46
  Bottom 0.254: v56.86,82.46 57.05,82.65 X1.3
DP+  (via drill 0.35)
  Top 0.254: v39.55,88.46 39.73,88.64 J1.B6 39.73,91.03 40.06,91.36 40.46,91.36 40.73,91.08 J1.A6 | U5.10 56.51,87.91 55.27,86.67 R8.2
  Bottom 0.254: v39.55,88.46 39.55,88.19 41.59,86.15 45.86,86.15 | D13.3 46.08,85.93 45.86,86.15 | U5.10 58.5,87.25 58.5,86.37 58.11,85.98 57.57,85.98 57.4,86.15 52.92,86.15 52.32,85.55 50.96,85.55 50.36,86.15 45.86,86.15
  other vias: 57.84,87.91
E11  (via drill 0.35)
  Top 0.152: U1.34 26.19,83.29 26.43,83.05 26.43,82.36 25.26,81.19 25.26,80.2 22.68,77.61 22.68,64.31 22.07,63.71 22.07,63.06 v22.68,62.46
  Bottom 0.152: MT1.A 10.59,62.75 22.38,62.75 v22.68,62.46
E12  (via drill 0.35)
  Top 0.152: v22.68,63.46 22.98,63.76 22.98,77.48 25.57,80.07 25.57,81.06 26.73,82.23 26.73,83.18 26.59,83.32 U1.35
  Bottom 0.152: MT1.B 15.29,63.06 22.28,63.06 v22.68,63.46
E21
  Top 0.152: U1.38 27.79,83.24 27.65,83.1 27.65,80.39 28.25,79.8 29.69,79.8 31.35,78.14 31.35,66.25 29.04,63.94 MT2.A
E22
  Top 0.152: U1.39 28.19,83.21 27.95,82.97 27.95,80.52 28.37,80.1 29.82,80.1 31.66,78.26 31.66,66.26 33.46,64.46 MT2.B
E31  (via drill 0.35)
  Top 0.152: v22.68,61.55 21.77,62.46 21.77,63.83 22.37,64.44 22.37,77.74 24.96,80.32 24.96,82.76 25.39,83.19 U1.32
  Bottom 0.152: MT3.A 44.83,61.26 22.97,61.26 v22.68,61.55
E32  (via drill 0.35)
  Top 0.152: U1.31 24.99,83.22 24.65,82.88 24.65,80.45 22.07,77.86 22.07,64.56 21.46,63.96 21.46,61.86 v22.68,60.64
  Bottom 0.152: MT3.B 49.52,60.95 22.99,60.95 v22.68,60.64
E41  (via drill 0.35)
  Top 0.152: v22.68,59.66 22.46,59.66 21.16,60.96 21.16,64.09 21.76,64.69 21.76,77.99 24.35,80.57 24.35,83.01 24.59,83.25 U1.30
  Bottom 0.152: MT4.A 66.56,60.86 65.06,59.36 22.98,59.36 v22.68,59.66
E42  (via drill 0.35)
  Top 0.152: U1.29 24.19,83.28 24.04,83.14 24.04,80.7 21.46,78.12 21.46,64.82 20.85,64.21 20.85,60.57 v22.68,58.75
  Bottom 0.152: MT4.B 71.56,60.36 70.25,59.05 22.98,59.05 v22.68,58.75
GND  (via drill 0.35)
  Top 0.152: U2.4 43.64,85.4 41.41,85.4 v40.8,86 | U1.57 25.79,89.11 U1.19 22.27,89.11 20.71,90.67 18.65,90.67 17.36,91.96 16.16,91.96 15.21,92.9 v15.14,92.9 | U5.12 65.56,90.45 67.25,90.45 v67.36,90.56
  Top 0.254: X5.GND 65.56,90.44 65.56,90.45
  Bottom 0.152: C17.1 44.93,82.16 46.36,82.16 | 46.36,82.16 46.92,82.16 U4.1 49.82,81.09 C16.1 | 46.36,82.16 46.29,82.22 46.29,83.91 47.03,84.64 D13.2 46.86,84.86 47.03,84.86 | 25.66,91.4 C3.1 26.79,90.21 U1.57 | 25.66,91.4 C9.1 29.47,91.4 C11.1 31.27,88.7 C1.1 C7.1 30.68,85.73 C12.1 31.27,84.24 C4.1 C2.1 29.94,82.89 29.94,83.09 29.17,83.86 C8.1 C5.1 23.2,86.62 C10.1 | C10.1 22.6,87.51 C6.1 23.2,88.94 25.66,91.4 | v67.36,90.56 67.55,90.36 | 67.55,90.36 C20.1 | 67.55,90.36 C18.2 C19.2 65.76,94.96 | 65.76,94.96 64.24,96.47 Y2.2 | Y2.4 62.72,93.56 64.39,93.56 64.83,94 64.83,94.03 65.76,94.96 | Y1.2 12.99,91.05 Y1.4 | Y1.4 12.82,90.78 C15.1 | Y1.4 11.46,92.13 11.46,92.66 11.36,92.76 11.36,93.46 12.82,94.91 C14.1 | C10.1 20.16,84.17 J2.2 | U$21.2 9.49,7.14 v7.14,7.14 | U$23.2 47.59,7.14 v42.86,7.14 | U$24.2 66.64,7.14 v64.29,7.14 | U$19.2 47.59,45.24 v45.24,45.24 | U$13.2 66.64,45.24 v64.29,45.24 | U$18.2 28.54,45.24 v26.19,45.24
  other vias: 26.79,88.11 21.43,57.15 38.7,83.94
  pour Top: -7.14,-4.76 -7.14,107.16 88.11,107.16 88.11,-7.14 -7.14,-7.14
  pour Bottom: -11.91,-7.14 -11.91,107.16 -7.14,111.92 88.11,111.92 92.87,107.16 92.87,-7.14 88.11,-11.91 -7.14,-11.91
L  (via drill 0.35)
  Top 0.152: U1.16 22.36,90.31 21.09,91.58 19.03,91.58 16.44,94.17 13.9,94.17 9.35,89.62 9.35,82.34 3.93,76.92 3.93,53.69 3.68,53.43 3.68,51.66 3.93,51.41 3.93,44.16 | 3.93,44.16 3.93,44.06 | 3.93,44.16 3.83,44.06 v3.63,44.06
  Bottom 0.152: v3.63,44.06 R10.1
N$1  (via drill 2.1)
  other vias: 78.58,2.38
N$2  (via drill 2.1)
  other vias: 2.38,2.38
N$3  (via drill 2.1)
  other vias: 2.38,82.15
N$4  (via drill 2.1)
  other vias: 78.58,82.15
N$5  (via drill 2.1)
  other vias: 21.43,40.48
N$6  (via drill 2.1)
  other vias: 59.53,40.48
N$7  (via drill 0.35)
  Top 0.305: J1.B4A9 38.03,88.48 v38.06,88.46 | v42.86,88.46 42.93,88.53 J1.A4B9 | v46.36,89.16 46.36,92.08 v48.06,93.78
  Bottom 0.305: v38.06,88.46 38.76,89.16 42.16,89.16 | v42.86,88.46 42.16,89.16 | 42.16,89.16 v46.36,89.16 47.03,88.48 D13.5 | 47.38,93.78 v48.06,93.78 R39.2
N$8
  Bottom 0.152: U$13.1 64.29,43.77
  Bottom 0.254: U$19.3 56.99,45.52 58.74,43.77 64.29,43.77 66.6,43.77
N$9
  Bottom 0.152: U$13.3 73.82,45.52
  Bottom 0.305: U$14.1 74.47,26.47 77.36,29.36 77.36,43.16 74.99,45.52 73.82,45.52 71.54,45.52
N$10
  Bottom 0.152: U$14.3 64.29,24.72
  Bottom 0.254: U$15.1 56.94,26.47 58.69,24.72 64.29,24.72 66.6,24.72
N$11
  Bottom 0.152: U$15.3 45.24,24.72
  Bottom 0.254: U$16.1 37.94,26.47 39.69,24.72 45.24,24.72 47.55,24.72
N$12
  Bottom 0.152: U$16.3 28.36,24.86 20.36,24.86 20.41,24.91
  Bottom 0.254: U$20.1 18.84,26.47 20.41,24.91 20.59,24.72 28.5,24.72
N$13  (via drill 0.35)
  Top 0.152: U1.46 31.47,86.71 31.52,86.66 31.52,86.24 32.05,85.71 32.8,85.71 33.34,86.24 33.34,86.66 33.81,87.13 v33.94,87.13
  Bottom 0.152: v33.94,87.13 34.43,87.13 36.57,89.26 37.43,89.26 41.03,92.86 45.68,92.86 46.48,92.06 55.85,92.06 56.46,91.46 56.46,89.06 56.1,88.7 R1.1
N$14  (via drill 0.35)
  Top 0.152: U1.47 31.51,87.11 31.82,86.8 31.82,86.37 32.18,86.01 32.68,86.01 33.03,86.37 33.03,86.78 33.34,87.09 33.34,87.38 33.69,87.73 34.2,87.73 34.55,87.38 34.55,86.81 v33.96,86.22
  Bottom 0.152: v33.96,86.22 36.7,88.96 37.56,88.96 41.16,92.56 45.56,92.56 46.36,91.76 54.86,91.76 55.64,90.97 R2.1
N$15
  Bottom 0.152: R4.1 17.26,93.35 15.66,94.95 C14.2 12.54,92.93 Y1.1
N$16  (via drill 0.35)
  Top 0.152: U2.1 41.37,82.03 v41.36,82.05
  Bottom 0.152: v41.36,82.05 R3.1
N$17
  Bottom 0.254: D1.A 16.94,51.64 18.26,52.96 U$1.P$4 U$1.MX2 U$1.P$3
N$18
  Bottom 0.254: D2.A 36.24,51.64 37.31,52.71 U$2.P$4 U$2.MX2 U$2.P$3
N$19  (via drill 0.35)
  Bottom 0.254: C18.1 57.88,91.68 U5.13
  other vias: 57.84,91.72
N$20  (via drill 0.35)
  Bottom 0.254: C19.1 58.02,93.17 U5.14
  other vias: 57.84,92.99
N$21  (via drill 0.35)
  Bottom 0.254: Y2.1 61.05,95.86 60.49,95.86 60.18,95.56 60.06,95.56 59.96,95.66 59.96,96.36 59.76,96.56 59.56,96.36 59.56,95.06 59.16,94.66 58.71,94.66 U5.16
  other vias: 57.84,95.53
N$22  (via drill 0.35)
  Bottom 0.254: Y2.3 63.12,95.46 60.66,95.46 59.46,94.26 U5.15
  other vias: 57.84,94.26
N$23
  Top 0.254: U5.2 54.76,94.26 56.86,96.36 66.86,96.36 69.65,93.56 69.65,86.99 X5.D+
N$24
  Top 0.254: U5.1 55.45,95.53 56.69,96.76 67.02,96.76 70.06,93.73 X5.D-
N$25
  Bottom 0.305: U$21.1 3.34,5.67 2.26,6.76 2.26,22.96 4.02,24.72 U$20.3
N$26
  Bottom 0.152: 21.86,5.86 28.36,5.86 U$22.1
  Bottom 0.254: U$21.3 20.29,7.42 21.86,5.86 22.04,5.67 28.5,5.67
N$27  (via drill 0.35)
  Top 0.254: U5.3 50.29,92.99 49.14,91.84 49.14,80.34 v48.99,80.19
  Bottom 0.254: v48.99,80.19 45.42,80.19 45.14,80.47 43.34,80.47 42.99,80.82 13.89,80.82 12.91,81.8 X4.D-
N$28  (via drill 0.35)
  Top 0.254: U5.4 50.52,91.72 49.54,90.74 49.54,80.57 v49.96,80.16
  Bottom 0.254: v49.96,80.16 49.33,79.53 48.72,79.53 48.47,79.79 45.25,79.79 44.97,80.07 43.17,80.07 42.82,80.42 12.09,80.42 10.9,81.61 X4.D+
N$29
  Bottom 0.152: U$23.1 45.24,5.67
  Bottom 0.254: U$22.3 37.99,7.42 39.74,5.67 45.24,5.67 47.55,5.67
N$30
  Bottom 0.152: U$24.1 64.29,5.67
  Bottom 0.254: U$23.3 56.89,7.42 58.64,5.67 64.29,5.67 66.6,5.67
N$31
  Bottom 0.254: U$3.P$3 U$3.MX2 U$3.P$4 56.36,53.36 54.64,51.64 D3.A
N$32
  Bottom 0.254: D4.A 74.24,51.64 75.41,52.81 U$4.P$4 U$4.MX2 U$4.P$3
N$33
  Bottom 0.254: MT1.2 14.41,73.79 D5.A
N$34
  Bottom 0.254: MT2.2 33.46,73.79 D6.A
N$35
  Bottom 0.254: MT3.2 52.51,73.79 D7.A
N$36
  Bottom 0.254: D8.A 71.56,73.79 MT4.2
N$37
  Bottom 0.254: D9.A 16.89,32.59 18.26,33.96 U$5.P$4 U$5.MX2 U$5.P$3
N$38
  Bottom 0.152: U$6.MX2 37.36,35.86 37.36,35.36 U$6.P$4
  Bottom 0.254: D10.A 36.09,32.59 37.31,33.81 U$6.P$4 | U$6.P$3 U$6.MX2
N$39
  Bottom 0.254: D11.A 55.09,32.59 56.36,33.86 U$7.P$4 U$7.MX2 U$7.P$3
N$40
  Bottom 0.254: D12.A 74.29,32.59 75.41,33.71 U$8.P$4 U$8.MX2 U$8.P$3
N$41
  Bottom 0.254: D14.A 16.74,13.54 18.26,15.06 U$9.P$4 U$9.MX2 U$9.P$3
N$42
  Bottom 0.254: D15.A 35.94,13.54 37.31,14.91 U$10.P$4 U$10.MX2 U$10.P$3
N$43
  Bottom 0.254: D16.A 55.24,13.54 56.36,14.66 U$11.P$4 U$11.MX2 U$11.P$3
N$44
  Bottom 0.254: D17.A 74.14,13.54 75.41,14.81 U$12.P$4 U$12.MX2 U$12.P$3
N$107
  Bottom 0.152: U$18.1 28.36,43.86 28.36,43.77
  Bottom 0.254: U$17.3 18.99,45.52 20.74,43.77 28.36,43.77 28.5,43.77
N$108
  Bottom 0.152: U$19.1 45.24,43.77
  Bottom 0.254: U$18.3 37.89,45.52 39.64,43.77 45.24,43.77 47.55,43.77
N$153  (via drill 0.35)
  Top 0.254: J1.B5 38.73,96.68 38.46,96.96 35.25,96.96 34.21,95.92 R6.1
  other vias: 34.21,95.85
N$154  (via drill 0.35)
  Top 0.254: J1.A5 41.73,96.43 42.26,96.96 45.64,96.96 R7.1
  other vias: 46.75,95.85
R1  (via drill 0.35)
  Top 0.152: U1.37 27.39,83.27 27.34,83.23 27.34,80.27 28.12,79.49 29.57,79.49 31.05,78.01 31.05,68.45 v30.66,68.06
  Bottom 0.254: D5.C 15.44,68.06 v30.66,68.06 31,68.06 | 31,68.06 D6.C | 31,68.06 50.05,68.06 | 50.05,68.06 D7.C | 50.05,68.06 69.06,68.06 70.8,69.8 D8.C
R2  (via drill 0.35)
  Top 0.152: U1.18 22.3,89.51 20.84,90.97 18.77,90.97 16.19,93.56 14.16,93.56 9.96,89.36 9.96,80.25 13.26,76.96 13.26,56.84 12.36,55.95 12.36,53.21 14.49,51.08 14.49,48.76 D1.C
  Bottom 0.254: 32.93,47.37 D2.C | D1.C 15.88,47.37 32.93,47.37 | 32.93,47.37 51.98,47.37 | 51.98,47.37 D3.C | 51.98,47.37 71.03,47.37 D4.C
  other vias: 14.88,48.37
R3  (via drill 0.35)
  Top 0.152: U1.27 22.81,85.91 22.65,85.75 22.65,83.73 23.43,82.95 23.43,80.95 20.85,78.37 20.85,65.07 20.24,64.47 20.24,43.47 19.05,42.28 19.05,38.93 20.25,37.73 20.25,28.62 v19.95,28.32
  Bottom 0.254: D12.C 71.03,28.32 54.58,28.32 | 54.58,28.32 D11.C | 54.58,28.32 34.93,28.32 | 34.93,28.32 D10.C | 34.93,28.32 v19.95,28.32 15.88,28.32 D9.C
R4  (via drill 0.35)
  Top 0.152: U1.28 22.96,85.11 22.96,83.86 23.74,83.08 23.74,80.83 21.15,78.24 21.15,64.94 20.55,64.34 20.55,43.35 19.36,42.16 19.36,39.06 20.56,37.86 20.56,9.47 v20.36,9.27
  Bottom 0.254: D17.C 71.03,9.27 53.98,9.27 | D16.C 53.98,9.27 | 53.98,9.27 34.93,9.27 | 34.93,9.27 D15.C | 34.93,9.27 v20.36,9.27 15.88,9.27 D14.C
RGB
  Bottom 0.152: U$17.1 7.7,43.77 R10.2
RST
  Top 0.152: U1.26 22.26,86.31 20.3,84.35 19.25,84.35 18.16,83.26 J2.3
  Bottom 0.254: RESET.1 7.15,93.17 10.66,89.66 10.66,88.56 12.66,86.56 13.36,86.56 14.16,85.76 14.16,84.06 15.07,83.14 15.07,82.04 15.86,81.26 18.66,81.26
  Bottom 0.305: R5.1 21.16,83.35 21.16,81.86 20.56,81.26 18.66,81.26 18.16,81.76 J2.3
SCLK
  Top 0.152: U1.52 31.48,89.11 32.11,89.74 32.11,89.97 32.64,90.51 33.4,90.51 33.93,89.97 33.93,88.86 35.5,87.29 35.5,85.02 35.94,84.57 U2.6
SD0
  Top 0.152: U1.53 31.45,89.51 31.81,89.87 31.81,90.1 32.52,90.81 33.53,90.81 34.24,90.1 34.24,88.98 35.8,87.42 35.8,86.01 35.97,85.84 U2.5
SD1
  Top 0.152: U1.55 31.15,90.31 32.27,91.42 33.78,91.42 34.85,90.35 34.85,89.23 36.41,87.67 36.41,86.93 36.68,86.67 37.98,86.67 39.55,85.09 44.94,85.09 45.12,84.92 45.12,83.62 44.8,83.3 U2.2
SD2
  Top 0.152: U1.54 31.42,89.91 31.5,89.99 31.5,90.22 32.39,91.12 33.65,91.12 34.54,90.22 34.54,89.11 36.11,87.55 36.11,86.81 36.55,86.36 37.85,86.36 39.64,84.57 U2.3
SD3
  Top 0.152: U1.51 31.51,88.71 32.42,89.61 32.42,89.85 32.77,90.2 33.27,90.2 33.63,89.85 33.63,88.73 35.19,87.17 35.19,83.82 35.71,83.3 U2.7
SS  (via drill 0.35)
  Top 0.152: U1.56 31.12,90.71 32.14,91.73 33.9,91.73 35.15,90.48 35.15,89.36 36.72,87.8 36.72,87.11 36.86,86.97 40.69,86.97 41.3,86.36 44.95,86.36 45.42,85.89 45.42,83.02 45.06,82.66 40.11,82.66 R3.2 39.61,80.01 v39.86,79.76
  Bottom 0.152: v39.86,79.76 39.55,80.06 2.76,80.06 1.79,79.09 BOOT.1
  other vias: 39.61,82.15
VCC  (via drill 0.35)
  Top 0.305: U4.3 48.22,84.4 R39.1 48.22,91.82 49.66,93.26 49.66,96.5 v49.45,96.71
  Bottom 0.254: C20.2 65.56,89
  Bottom 0.305: U4.3 49.82,83.21 C16.2 | U5.11 58.96,89.18 | 58.96,89.18 60.08,89.18 61.06,90.16 63.76,90.16 64.91,89 65.56,89 | C20.2 65.8,88.51 66.86,87.46 70.48,87.46 X5.VBUS | v49.45,96.71 49.23,96.93 19.63,96.93 18.46,95.76 18.46,90.68 17.86,90.08 16.87,90.08 16.16,89.36 16.16,86.15 X4.VBUS | 58.96,89.18 59.06,89.08 59.06,86.16 58.02,85.12 51.22,85.12 50.01,83.91 C16.2 | C16.2 52.38,80.65 X1.1
  other vias: 48.22,90.77 47.03,83.21 57.84,89.18
XTAL1  (via drill 0.35)
  Top 0.152: U1.20 22.24,88.71 20.58,90.36 18,90.36 R4.2
  other vias: 17.26,91.1
XTAL2  (via drill 0.35)
  Top 0.152: U1.21 22.21,88.31 20.46,90.06 15.62,90.06 C15.2
  Bottom 0.152: Y1.3 14.25,90.46 14.25,89.32 C15.2
  other vias: 14.57,89